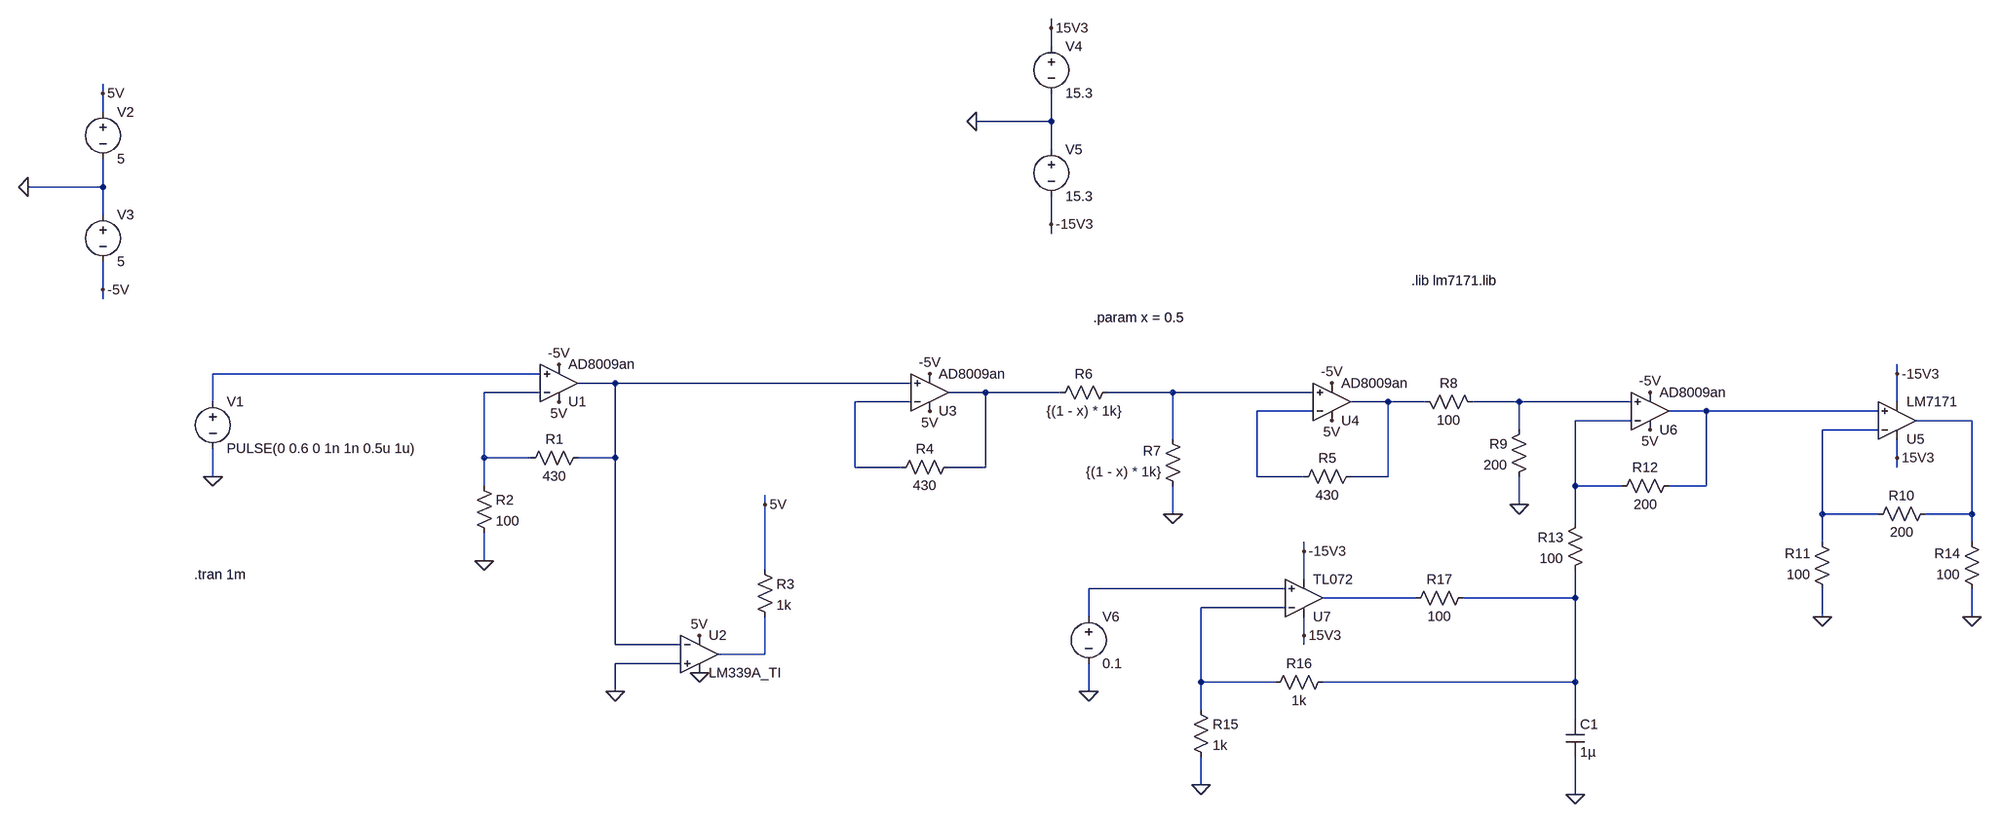
[diagram p0: schematic 201_cd_offset.asc]
201_cd_offset.asc, the LTspice schematic file:
Version 4
SHEET 1 2964 680
WIRE 1328 -848 1328 -864
WIRE 1328 -816 1328 -848
WIRE -592 -736 -592 -752
WIRE -592 -704 -592 -736
WIRE 1328 -688 1328 -736
WIRE 1328 -688 1200 -688
WIRE 1328 -640 1328 -688
WIRE -592 -576 -592 -624
WIRE -592 -576 -720 -576
WIRE -592 -528 -592 -576
WIRE 1328 -512 1328 -560
WIRE 1328 -496 1328 -512
WIRE -592 -400 -592 -448
WIRE -592 -384 -592 -400
WIRE 256 -256 -304 -256
WIRE 2816 -256 2816 -272
WIRE 384 -240 320 -240
WIRE 1088 -240 384 -240
WIRE 256 -224 160 -224
WIRE 1216 -224 1152 -224
WIRE 1344 -224 1216 -224
WIRE 1536 -224 1424 -224
WIRE 1776 -224 1536 -224
WIRE -304 -208 -304 -256
WIRE 1088 -208 992 -208
WIRE 1904 -208 1840 -208
WIRE 1968 -208 1904 -208
WIRE 2128 -208 2048 -208
WIRE 2320 -208 2128 -208
WIRE 2816 -208 2816 -256
WIRE 1776 -192 1680 -192
WIRE 2448 -192 2384 -192
WIRE 2784 -192 2448 -192
WIRE 2320 -176 2224 -176
WIRE 2944 -176 2848 -176
WIRE 2128 -160 2128 -208
WIRE 2784 -160 2688 -160
WIRE 1536 -144 1536 -224
WIRE 160 -112 160 -224
WIRE 240 -112 160 -112
WIRE 384 -112 384 -240
WIRE 384 -112 320 -112
WIRE 2816 -112 2816 -144
WIRE 992 -96 992 -208
WIRE 1072 -96 992 -96
WIRE 1216 -96 1216 -224
WIRE 1216 -96 1152 -96
WIRE 2816 -96 2816 -112
WIRE -304 -80 -304 -128
WIRE 1680 -80 1680 -192
WIRE 1760 -80 1680 -80
WIRE 1904 -80 1904 -208
WIRE 1904 -80 1840 -80
WIRE 160 -64 160 -112
WIRE 2224 -64 2224 -176
WIRE 2304 -64 2224 -64
WIRE 2448 -64 2448 -192
WIRE 2448 -64 2384 -64
WIRE 640 -32 640 -48
WIRE 2128 -32 2128 -80
WIRE 1536 -16 1536 -64
WIRE 2688 -16 2688 -160
WIRE 2784 -16 2688 -16
WIRE 2944 -16 2944 -176
WIRE 2944 -16 2864 -16
WIRE 2224 0 2224 -64
WIRE 2688 32 2688 -16
WIRE 2944 32 2944 -16
WIRE 1760 48 1760 32
WIRE 160 64 160 16
WIRE 640 80 640 -32
WIRE 1760 96 1760 48
WIRE 1728 112 1392 112
WIRE 1952 128 1792 128
WIRE 2224 128 2224 80
WIRE 2224 128 2032 128
WIRE 1728 144 1584 144
WIRE 1392 160 1392 112
WIRE 2688 160 2688 112
WIRE 2944 160 2944 112
WIRE 1760 192 1760 160
WIRE 384 208 384 -112
WIRE 496 208 384 208
WIRE 1760 208 1760 192
WIRE 640 224 640 160
WIRE 640 224 560 224
WIRE 496 240 384 240
WIRE 1584 272 1584 144
WIRE 1712 272 1584 272
WIRE 2224 272 2224 128
WIRE 2224 272 1792 272
WIRE 384 288 384 240
WIRE 1392 288 1392 240
WIRE 1584 320 1584 272
WIRE 2224 336 2224 272
WIRE 1584 448 1584 400
WIRE 2224 464 2224 400
FLAG 288 -208 5V
FLAG 528 192 5V
FLAG 288 -272 -5V
FLAG 160 64 0
FLAG -304 -80 0
FLAG 384 288 0
FLAG 640 -32 5V
FLAG -720 -576 0
FLAG -592 -400 -5V
FLAG -592 -736 5V
FLAG 1120 -192 5V
FLAG 1120 -256 -5V
FLAG 528 256 0
FLAG 1808 -176 5V
FLAG 1808 -240 -5V
FLAG 1536 -16 0
FLAG 2128 -32 0
FLAG 1200 -688 0
FLAG 1328 -512 -15V3
FLAG 1328 -848 15V3
FLAG 2816 -256 -15V3
FLAG 2816 -112 15V3
FLAG 2688 160 0
FLAG 2352 -160 5V
FLAG 2352 -224 -5V
FLAG 2944 160 0
FLAG 1760 48 -15V3
FLAG 1760 192 15V3
FLAG 1584 448 0
FLAG 1392 288 0
FLAG 2224 464 0
SYMBOL ZZZ\\OpAmp\\AD8009an 288 -240 M180
SYMATTR InstName U1
SYMBOL ZZZ\\Comparator\\LM339A_TI 528 224 R0
SYMATTR InstName U2
SYMBOL res 336 -128 R90
WINDOW 0 0 56 VBottom 2
WINDOW 3 32 56 VTop 2
SYMATTR InstName R1
SYMATTR Value 430
SYMBOL res 144 -80 R0
SYMATTR InstName R2
SYMATTR Value 100
SYMBOL voltage -304 -224 R0
WINDOW 123 0 0 Left 0
WINDOW 39 0 0 Left 0
SYMATTR InstName V1
SYMATTR Value PULSE(0 0.6 0 1n 1n 0.5u 1u)
SYMBOL res 624 64 R0
SYMATTR InstName R3
SYMATTR Value 1k
SYMBOL voltage -592 -720 R0
WINDOW 123 0 0 Left 0
WINDOW 39 0 0 Left 0
SYMATTR InstName V2
SYMATTR Value 5
SYMBOL voltage -592 -544 R0
WINDOW 123 0 0 Left 0
WINDOW 39 0 0 Left 0
SYMATTR InstName V3
SYMATTR Value 5
SYMBOL ZZZ\\OpAmp\\AD8009an 1120 -224 M180
SYMATTR InstName U3
SYMBOL res 1168 -112 R90
WINDOW 0 0 56 VBottom 2
WINDOW 3 32 56 VTop 2
SYMATTR InstName R4
SYMATTR Value 430
SYMBOL ZZZ\\OpAmp\\AD8009an 1808 -208 M180
SYMATTR InstName U4
SYMBOL res 1856 -96 R90
WINDOW 0 0 56 VBottom 2
WINDOW 3 32 56 VTop 2
SYMATTR InstName R5
SYMATTR Value 430
SYMBOL res 1440 -240 R90
WINDOW 0 0 56 VBottom 2
WINDOW 3 32 56 VTop 2
SYMATTR InstName R6
SYMATTR Value {(1 - x) * 1k}
SYMBOL res 1552 -48 R180
WINDOW 0 36 76 Left 2
WINDOW 3 36 40 Left 2
SYMATTR InstName R7
SYMATTR Value {(1 - x) * 1k}
SYMBOL res 1952 -224 M90
WINDOW 0 0 56 VBottom 2
WINDOW 3 32 56 VTop 2
SYMATTR InstName R8
SYMATTR Value 100
SYMBOL res 2144 -176 M0
SYMATTR InstName R9
SYMATTR Value 200
SYMBOL OpAmps\\opamp2 2816 -112 M180
SYMATTR InstName U5
SYMATTR Value LM7171
SYMBOL voltage 1328 -832 R0
WINDOW 123 0 0 Left 0
WINDOW 39 0 0 Left 0
SYMATTR InstName V4
SYMATTR Value 15.3
SYMBOL voltage 1328 -656 R0
WINDOW 123 0 0 Left 0
WINDOW 39 0 0 Left 0
SYMATTR InstName V5
SYMATTR Value 15.3
SYMBOL res 2880 -32 R90
WINDOW 0 0 56 VBottom 2
WINDOW 3 32 56 VTop 2
SYMATTR InstName R10
SYMATTR Value 200
SYMBOL res 2704 128 R180
WINDOW 0 36 76 Left 2
WINDOW 3 36 40 Left 2
SYMATTR InstName R11
SYMATTR Value 100
SYMBOL ZZZ\\OpAmp\\AD8009an 2352 -192 M180
SYMATTR InstName U6
SYMBOL res 2400 -80 R90
WINDOW 0 0 56 VBottom 2
WINDOW 3 32 56 VTop 2
SYMATTR InstName R12
SYMATTR Value 200
SYMBOL res 2240 -16 M0
SYMATTR InstName R13
SYMATTR Value 100
SYMBOL res 2960 128 R180
WINDOW 0 36 76 Left 2
WINDOW 3 36 40 Left 2
SYMATTR InstName R14
SYMATTR Value 100
SYMBOL ZZZ\\OpAmp\\TL072 1760 128 M180
SYMATTR InstName U7
SYMBOL res 1568 304 R0
SYMATTR InstName R15
SYMATTR Value 1k
SYMBOL res 1808 256 R90
WINDOW 0 0 56 VBottom 2
WINDOW 3 32 56 VTop 2
SYMATTR InstName R16
SYMATTR Value 1k
SYMBOL voltage 1392 144 R0
WINDOW 123 0 0 Left 0
WINDOW 39 0 0 Left 0
SYMATTR InstName V6
SYMATTR Value 0.1
SYMBOL cap 2208 336 R0
SYMATTR InstName C1
SYMATTR Value 1µ
SYMBOL res 2048 112 R90
WINDOW 0 0 56 VBottom 2
WINDOW 3 32 56 VTop 2
SYMATTR InstName R17
SYMATTR Value 100
TEXT -336 88 Left 2 !.tran 1m
TEXT 1400 -352 Left 2 !.param x = 0.5
TEXT 1944 -416 Left 2 !.lib lm7171.lib

The netlist it stands for:
* 201_cd_offset.asc
* U1: AD8009an (symbol ZZZ\OpAmp\AD8009an not available, pins judged from their places): In+=N001 In-=N003 V+=5V V-=-5V OUT=N002
* U2: LM339A_TI (symbol ZZZ\Comparator\LM339A_TI not available, pins judged from their places): In+=0 In-=N002 V+=5V V-=0 OUT=N018
R1 N002 N003 430
R2 N003 0 100
V1 N001 0 PULSE(0 0.6 0 1n 1n 0.5u 1u)
R3 5V N018 1k
V2 5V 0 5
V3 0 -5V 5
* U3: AD8009an (symbol ZZZ\OpAmp\AD8009an not available, pins judged from their places): In+=N002 In-=N006 V+=5V V-=-5V OUT=N004
R4 N004 N006 430
* U4: AD8009an (symbol ZZZ\OpAmp\AD8009an not available, pins judged from their places): In+=N005 In-=N009 V+=5V V-=-5V OUT=N007
R5 N007 N009 430
R6 N005 N004 {(1 - x) * 1k}
R7 0 N005 {(1 - x) * 1k}
R8 N007 N008 100
R9 N008 0 200
XU5 N010 N013 15V3 -15V3 N012 LM7171  ; pins In+ In- V+ V- OUT
V4 15V3 0 15.3
V5 0 -15V3 15.3
R10 N012 N013 200
R11 0 N013 100
* U6: AD8009an (symbol ZZZ\OpAmp\AD8009an not available, pins judged from their places): In+=N008 In-=N011 V+=5V V-=-5V OUT=N010
R12 N010 N011 200
R13 N011 N016 100
R14 0 N012 100
* U7: TL072 (symbol ZZZ\OpAmp\TL072 not available, pins judged from their places): In+=N014 In-=N017 V+=15V3 V-=-15V3 OUT=N015
R15 N017 0 1k
R16 N016 N017 1k
V6 N014 0 0.1
C1 N016 0 1µ
R17 N016 N015 100
.tran 1m
.param x = 0.5
.lib lm7171.lib
.backanno
.end